# Altium project PCB_Project.PrjPcb (part 1 of 2)
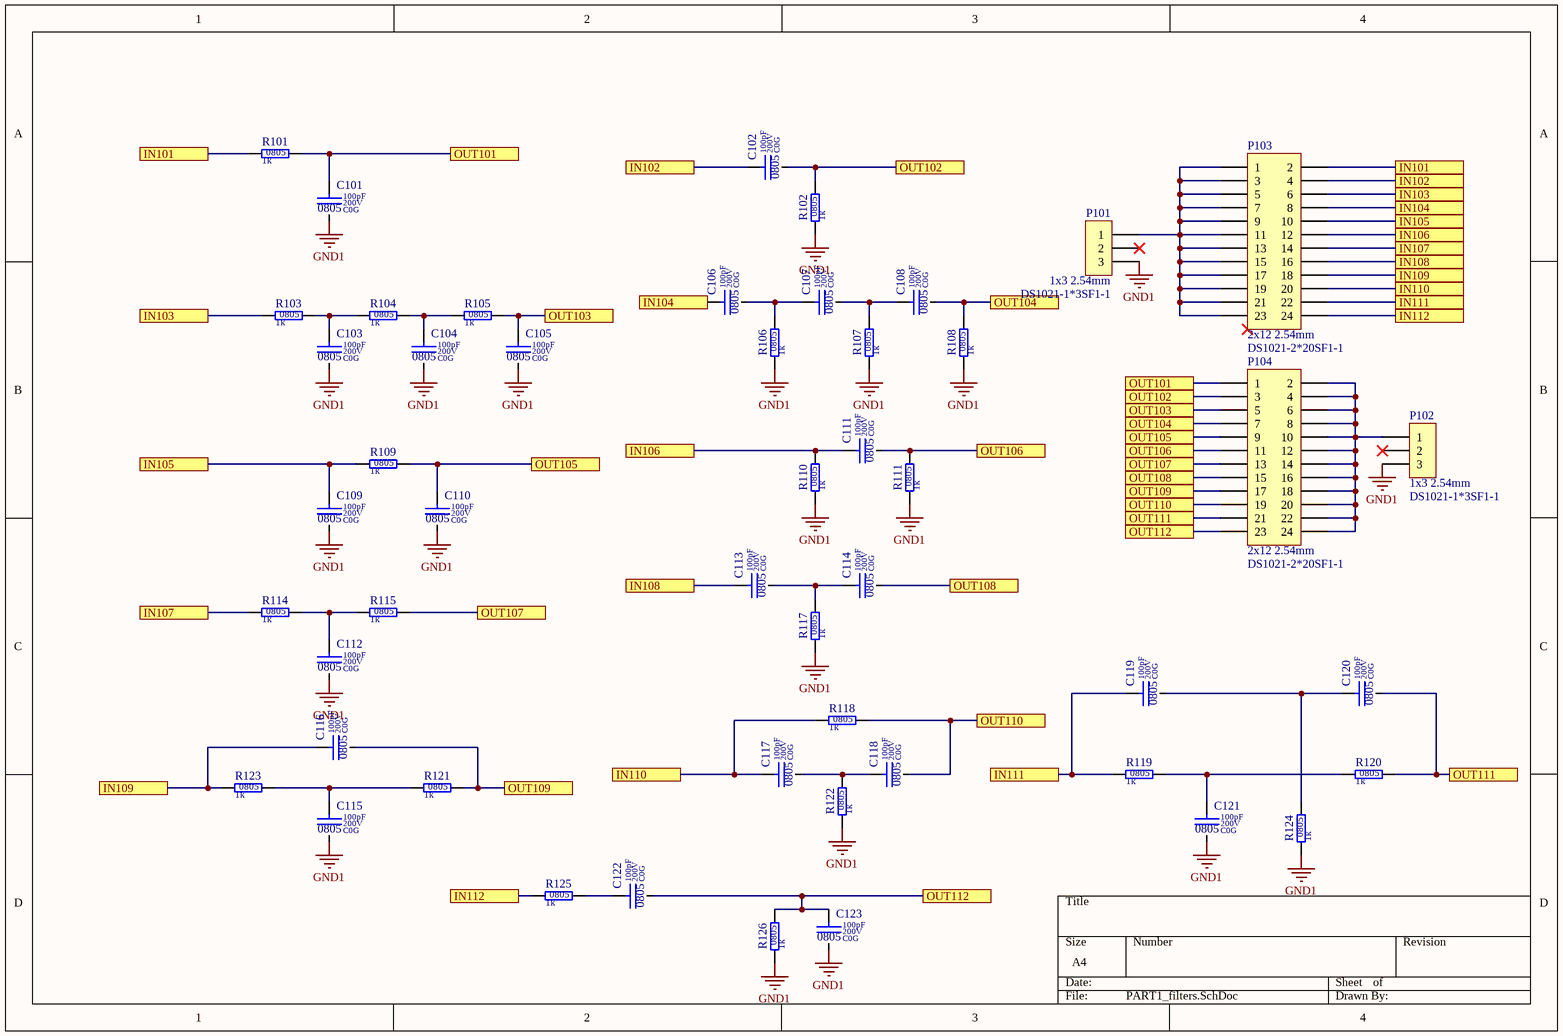
[diagram p0: PART1_filters.SchDoc]
12 sheets, 220 parts. Net scope: flat (ports and power ports of the same name join across sheets).
Board file: PCB1.PcbDoc
Sheets:
  PART1_filters.SchDoc
  PART2_zener_stab.SchDoc
  PART3_Volt_Reg.SchDoc
  PART4_CMOS_Driver.SchDoc
  PART5_Step_Down_PSU.SchDoc
  PART6_Step_Up_PSU.SchDoc
  PART8_Volt_Multipl.SchDoc
  PART7_op_amp.SchDoc
  PART9_0_Volt_Protec_Simple.SchDoc
  PART10_Ast_Multivib_w_DC_DC_COnv.SchDoc
  PART11_Rectifier.SchDoc
  GND.SchDoc

## Sheet PART1_filters.SchDoc: PART1_RC_filters
size A4

### Parts
C101  value 100pF  Dielectric: C0G  Voltage: 200V  SCH_Footprint: 0805  [C_0805_2012]  (hidden comment: Ceramic C0G)
C102  value 100pF  Dielectric: C0G  Voltage: 200V  SCH_Footprint: 0805  [C_0805_2012]  (hidden comment: Ceramic C0G)
C103  value 100pF  Dielectric: C0G  Voltage: 200V  SCH_Footprint: 0805  [C_0805_2012]  (hidden comment: Ceramic C0G)
C104  value 100pF  Dielectric: C0G  Voltage: 200V  SCH_Footprint: 0805  [C_0805_2012]  (hidden comment: Ceramic C0G)
C105  value 100pF  Dielectric: C0G  Voltage: 200V  SCH_Footprint: 0805  [C_0805_2012]  (hidden comment: Ceramic C0G)
C106  value 100pF  Dielectric: C0G  Voltage: 200V  SCH_Footprint: 0805  [C_0805_2012]  (hidden comment: Ceramic C0G)
C107  value 100pF  Dielectric: C0G  Voltage: 200V  SCH_Footprint: 0805  [C_0805_2012]  (hidden comment: Ceramic C0G)
C108  value 100pF  Dielectric: C0G  Voltage: 200V  SCH_Footprint: 0805  [C_0805_2012]  (hidden comment: Ceramic C0G)
C109  value 100pF  Dielectric: C0G  Voltage: 200V  SCH_Footprint: 0805  [C_0805_2012]  (hidden comment: Ceramic C0G)
C110  value 100pF  Dielectric: C0G  Voltage: 200V  SCH_Footprint: 0805  [C_0805_2012]  (hidden comment: Ceramic C0G)
C111  value 100pF  Dielectric: C0G  Voltage: 200V  SCH_Footprint: 0805  [C_0805_2012]  (hidden comment: Ceramic C0G)
C112  value 100pF  Dielectric: C0G  Voltage: 200V  SCH_Footprint: 0805  [C_0805_2012]  (hidden comment: Ceramic C0G)
C113  value 100pF  Dielectric: C0G  Voltage: 200V  SCH_Footprint: 0805  [C_0805_2012]  (hidden comment: Ceramic C0G)
C114  value 100pF  Dielectric: C0G  Voltage: 200V  SCH_Footprint: 0805  [C_0805_2012]  (hidden comment: Ceramic C0G)
C115  value 100pF  Dielectric: C0G  Voltage: 200V  SCH_Footprint: 0805  [C_0805_2012]  (hidden comment: Ceramic C0G)
C116  value 100pF  Dielectric: C0G  Voltage: 200V  SCH_Footprint: 0805  [C_0805_2012]  (hidden comment: Ceramic C0G)
C117  value 100pF  Dielectric: C0G  Voltage: 200V  SCH_Footprint: 0805  [C_0805_2012]  (hidden comment: Ceramic C0G)
C118  value 100pF  Dielectric: C0G  Voltage: 200V  SCH_Footprint: 0805  [C_0805_2012]  (hidden comment: Ceramic C0G)
C119  value 100pF  Dielectric: C0G  Voltage: 200V  SCH_Footprint: 0805  [C_0805_2012]  (hidden comment: Ceramic C0G)
C120  value 100pF  Dielectric: C0G  Voltage: 200V  SCH_Footprint: 0805  [C_0805_2012]  (hidden comment: Ceramic C0G)
C121  value 100pF  Dielectric: C0G  Voltage: 200V  SCH_Footprint: 0805  [C_0805_2012]  (hidden comment: Ceramic C0G)
C122  value 100pF  Dielectric: C0G  Voltage: 200V  SCH_Footprint: 0805  [C_0805_2012]  (hidden comment: Ceramic C0G)
C123  value 100pF  Dielectric: C0G  Voltage: 200V  SCH_Footprint: 0805  [C_0805_2012]  (hidden comment: Ceramic C0G)
P101  value DS1021-1*3SF1-1  SCH_Footprint: 1x3 2.54mm  [P_HEADER_1x3_2.54]  (hidden comment: Goldpin)
P102  value DS1021-1*3SF1-1  SCH_Footprint: 1x3 2.54mm  [P_HEADER_1x3_2.54]  (hidden comment: Goldpin)
P103  value DS1021-2*20SF1-1  SCH_Footprint: 2x12 2.54mm  [P_HEADER_2x12_2.54]  (hidden comment: IN)
P104  value DS1021-2*20SF1-1  SCH_Footprint: 2x12 2.54mm  [P_HEADER_2x12_2.54]  (hidden comment: OUT)
R101  value 1k  SCH_Footprint: 0805  [R_0805_2012]  (hidden comment: Resistor)
R102  value 1k  SCH_Footprint: 0805  [R_0805_2012]  (hidden comment: Resistor)
R103  value 1k  SCH_Footprint: 0805  [R_0805_2012]  (hidden comment: Resistor)
R104  value 1k  SCH_Footprint: 0805  [R_0805_2012]  (hidden comment: Resistor)
R105  value 1k  SCH_Footprint: 0805  [R_0805_2012]  (hidden comment: Resistor)
R106  value 1k  SCH_Footprint: 0805  [R_0805_2012]  (hidden comment: Resistor)
R107  value 1k  SCH_Footprint: 0805  [R_0805_2012]  (hidden comment: Resistor)
R108  value 1k  SCH_Footprint: 0805  [R_0805_2012]  (hidden comment: Resistor)
R109  value 1k  SCH_Footprint: 0805  [R_0805_2012]  (hidden comment: Resistor)
R110  value 1k  SCH_Footprint: 0805  [R_0805_2012]  (hidden comment: Resistor)
R111  value 1k  SCH_Footprint: 0805  [R_0805_2012]  (hidden comment: Resistor)
R114  value 1k  SCH_Footprint: 0805  [R_0805_2012]  (hidden comment: Resistor)
R115  value 1k  SCH_Footprint: 0805  [R_0805_2012]  (hidden comment: Resistor)
R117  value 1k  SCH_Footprint: 0805  [R_0805_2012]  (hidden comment: Resistor)
R118  value 1k  SCH_Footprint: 0805  [R_0805_2012]  (hidden comment: Resistor)
R119  value 1k  SCH_Footprint: 0805  [R_0805_2012]  (hidden comment: Resistor)
R120  value 1k  SCH_Footprint: 0805  [R_0805_2012]  (hidden comment: Resistor)
R121  value 1k  SCH_Footprint: 0805  [R_0805_2012]  (hidden comment: Resistor)
R122  value 1k  SCH_Footprint: 0805  [R_0805_2012]  (hidden comment: Resistor)
R123  value 1k  SCH_Footprint: 0805  [R_0805_2012]  (hidden comment: Resistor)
R124  value 1k  SCH_Footprint: 0805  [R_0805_2012]  (hidden comment: Resistor)
R125  value 1k  SCH_Footprint: 0805  [R_0805_2012]  (hidden comment: Resistor)
R126  value 1k  SCH_Footprint: 0805  [R_0805_2012]  (hidden comment: Resistor)

### Ports
IN101, IN102, IN103, IN104, IN105, IN106, IN107, IN108, IN109, IN110, IN111, IN112, OUT101, OUT102, OUT103, OUT104, OUT105, OUT106, OUT107, OUT108, OUT109, OUT110, OUT111, OUT112

### Nets
GND1: C101.2 C103.2 C104.2 C105.2 C109.2 C110.2 C112.2 C115.2 C121.2 C123.2 P101.3 P102.3 R102.1 R106.1 R107.1 R108.1 R110.1 R111.1 R117.1 R122.1 R124.1 R126.1
NetC101_1: C101.1 P104.1 R101.2 ; port OUT101
NetC102_1: C102.1 P103.4 ; port IN102
NetC102_2: C102.2 P104.3 R102.2 ; port OUT102
NetC103_1: C103.1 R103.2 R104.1
NetC104_1: C104.1 R104.2 R105.1
NetC105_1: C105.1 P104.5 R105.2 ; port OUT103
NetC106_1: C106.1 P103.8 ; port IN104
NetC106_2: C106.2 C107.1 R106.2
NetC107_2: C107.2 C108.1 R107.2
NetC108_2: C108.2 P104.7 R108.2 ; port OUT104
NetC109_1: C109.1 P103.10 R109.1 ; port IN105
NetC110_1: C110.1 P104.9 R109.2 ; port OUT105
NetC111_1: C111.1 P103.12 R110.2 ; port IN106
NetC111_2: C111.2 P104.11 R111.2 ; port OUT106
NetC112_1: C112.1 R114.2 R115.1
NetC113_1: C113.1 P103.16 ; port IN108
NetC113_2: C113.2 C114.1 R117.2
NetC114_2: C114.2 P104.15 ; port OUT108
NetC115_1: C115.1 R121.1 R123.2
NetC116_1: C116.1 P103.18 R123.1 ; port IN109
NetC116_2: C116.2 P104.17 R121.2 ; port OUT109
NetC117_1: C117.1 P103.20 R118.1 ; port IN110
NetC117_2: C117.2 C118.1 R122.2
NetC118_2: C118.2 P104.19 R118.2 ; port OUT110
NetC119_1: C119.1 P103.22 R119.1 ; port IN111
NetC119_2: C119.2 C120.1 R124.2
NetC120_2: C120.2 P104.21 R120.2 ; port OUT111
NetC121_1: C121.1 R119.2 R120.1
NetC122_1: C122.1 R125.2
NetC122_2: C122.2 C123.1 P104.23 R126.2 ; port OUT112
NetP101_1: P101.1 P103.1 P103.3 P103.5 P103.7 P103.9 P103.11 P103.13 P103.15 P103.17 P103.19 P103.21 P103.23
NetP102_1: P102.1 P104.2 P104.4 P104.6 P104.8 P104.10 P104.12 P104.14 P104.16 P104.18 P104.20 P104.22 P104.24
NetP103_2: P103.2 R101.1 ; port IN101
NetP103_6: P103.6 R103.1 ; port IN103
NetP103_14: P103.14 R114.1 ; port IN107
NetP103_24: P103.24 R125.1 ; port IN112
NetP104_13: P104.13 R115.2 ; port OUT107

Not connected (* = marked no-connect by the designer): P101 2*; P102 2*

### Library data of the parts
C101-C123 = C_100pF_200V_C0G_0805_5: Capacitor; Manufacturer: KEMET; Manufacturer Part Number: C0805C101J2GACTU; Tolerance (%): 5; Part Number: C_100pF_200V_C0G_0805_5; HelpURL: http://www.tme.eu/pl/Document/a556da97341b52257167181ac42b746d/KEM_C1003_C0G_SMD.pdf; Supplier 1: TME; Supplier Part Number 1: C0805C101J2GAC; Supplier 2: RS Components; Supplier 3: Farnell; Supplier 4: Mouser; Supplier 5: Digi-Key
P101 P102 = P_HEADER_1x3_2.54: Pin Header; Manufacturer: Connfly; Part Number: P_HEADER_1x3_2.54; Component Type: Standard; HelpURL: http://www.tme.eu/en/Document/cc301e58a5da78cb543a94b5a5b7f06a/DS1021.pdf; Manufacturer Part Number: DS1021-1*3SF1-1; Supplier 1: TME; Supplier Part Number 1: ZL201-03G; Supplier 2: RS Components; Supplier 3: Farnell; Supplier 4: Mouser; Supplier 5: Digi-Key
P103 P104 = P_HEADER_2x12_2.54: Pin Header; Manufacturer: Connfly; Part Number: P_HEADER_2x12_2.54; Component Type: Standard; HelpURL: https://www.tme.eu/Document/cc301e58a5da78cb543a94b5a5b7f06a/DS1021.pdf; Manufacturer Part Number: DS1021-2*20SF1-1; Supplier 1: TME; Supplier Part Number 1: ZL202-40G; Supplier 2: RS Components; Supplier 3: Farnell; Supplier 4: Mouser; Supplier 5: Digi-Key
R101-R111 R114 R115 R117-R126 = R_1k_0805_1: Manufacturer: Royalohm; Manufacturer Part Number: HP05W3F1001T5E; Voltage: 150V; Power: 300mW; Tolerance: 1%; Part Number: R_1k_0805_1; HelpURL: https://www.tme.eu/pl/Document/63d5a2fbb689d2d511047d7cc8640cd8/chip_resistor_hp.pdf; Supplier 1: TME; Supplier Part Number 1: HP05-1K1%; Supplier 2: RS Components; Supplier 3: Farnell; Supplier 4: Mouser; Supplier 5: Digi-Key

## Sheet PART2_zener_stab.SchDoc
size A4
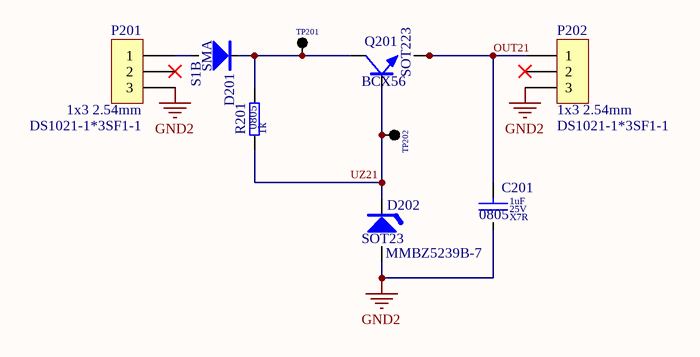
[diagram p1: PART2_zener_stab.SchDoc]

### Parts
C201  value 1uF  Dielectric: X7R  Voltage: 25V  SCH_Footprint: 0805  [C_0805_2012]  (hidden comment: Ceramic X7R)
D201  value S1B  SCH_Footprint: SMA  [SMA_DO-214AC]
D202  value MMBZ5239B-7  SCH_Footprint: SOT23  [D_SOT23_TO236_SC59]
P201  value DS1021-1*3SF1-1  SCH_Footprint: 1x3 2.54mm  [P_HEADER_1x3_2.54]  (hidden comment: Goldpin)
P202  value DS1021-1*3SF1-1  SCH_Footprint: 1x3 2.54mm  [P_HEADER_1x3_2.54]  (hidden comment: Goldpin)
Q201  SCH_Footprint: SOT223  [SOT-223_M]  (hidden comment: BCX56)
R201  value 1k  SCH_Footprint: 0805  [R_0805_2012]  (hidden comment: Resistor)
TP201  Single pin  [TP_1PIN]  (value not drawn)
TP202  Single pin  [TP_1PIN]  (value not drawn)

### Nets
GND2: C201.2 D202.2(A) P201.3 P202.3
OUT21: C201.1 P202.1 Q201.1(C) Q201.3(E)
UZ21: D202.1(K) Q201.4(B) R201.1 TP202.1(TP)
NetD201_1: D201.1 Q201.2(C) R201.2 TP201.1(TP)
NetD201_2: D201.2 P201.1

Not connected (* = marked no-connect by the designer): P201 2*; P202 2*

### Library data of the parts
C201 = C_1uF_25V_X7R_0805_10: Capacitor; Manufacturer: AVX; Manufacturer Part Number: 08053C105KAT2A; Tolerance (%): 10; Part Number: C_1uF_25V_X7R_0805_10; HelpURL: https://www.tme.eu/Document/667fe6e7748c0ed1675574c6bf64b751/AVX_X7R.pdf; Supplier 1: TME; Supplier Part Number 1: 08053C105KAT2A; Supplier 2: RS Components; Supplier Part Number 2: 1351396; Supplier 3: Farnell; Supplier Part Number 3: 1658877; Supplier 4: Mouser; Supplier Part Number 4: 581-08053C105KAT2A; Supplier 5: Digi-Key; Supplier Part Number 5: 478-5030-1-ND
D201 = D_S1B_1A_100V_SMA: Manufacturer: Vishay/General Semiconductor; Voltage: 100V; Current: 1A; Part Number: D_S1B_1A_100V_SMA; Manufacturer Part Number: S1B; Supplier 1: TME; Supplier 2: RS Components; Supplier 3: Farnell; Supplier 4: Mouser; Supplier Part Number 4: 821-S1B; Supplier 5: Digi-Key; Supplier Part Number 5: S1B/51GI
D202 = DZ_9V1_SOT23: Zener; Manufacturer: Diodes Inc; Voltage: 9.1V; Part Number: DZ_9V1_SOT23; Manufacturer Part Number: MMBZ5239B-7; Supplier 1: TME; Supplier 2: RS Components; Supplier 3: Farnell; Supplier 4: Mouser; Supplier 5: Digi-Key; Supplier Part Number 5: MMBZ5239B-FDICT-ND
P201 P202 = P_HEADER_1x3_2.54: Pin Header; Manufacturer: Connfly; Part Number: P_HEADER_1x3_2.54; Component Type: Standard; HelpURL: http://www.tme.eu/en/Document/cc301e58a5da78cb543a94b5a5b7f06a/DS1021.pdf; Manufacturer Part Number: DS1021-1*3SF1-1; Supplier 1: TME; Supplier Part Number 1: ZL201-03G; Supplier 2: RS Components; Supplier 3: Farnell; Supplier 4: Mouser; Supplier 5: Digi-Key
Q201 = QNP_BCX56: Manufacturer: Nexperia; Type: NPN; Voltage: 80V; Current: 1A; Part Number: QNP_BCX56; Value: BCX56; HelpURL: https://datasheet.octopart.com/BCX56-10%2C115-Nexperia-datasheet-78799842.pdf; Manufacturer Part Number: BCX56; Supplier 1: TME; Supplier 2: RS Components; Supplier Part Number 2: 725-8540; Supplier 3: Farnell; Supplier Part Number 3: 1757914; Supplier 4: Mouser; Supplier Part Number 4: 771-BCX56-10-T/R; Supplier 5: Digi-Key; Supplier Part Number 5: 1727-4318-1-ND-ND
R201 = R_1k_0805_1: as R101 on sheet PART1_filters; Part Number: R_1k_0805_1; HelpURL: https://www.tme.eu/pl/Document/63d5a2fbb689d2d511047d7cc8640cd8/chip_resistor_hp.pdf; Supplier 1: TME; Supplier Part Number 1: HP05-1K1%; Supplier 2: RS Components; Supplier 3: Farnell; Supplier 4: Mouser; Supplier 5: Digi-Key
TP201 TP202 = TP_1PIN: Testpoint; SCH_Footprint: Single; Part Number: TP_1PIN; Component Type: Standard; Supplier 1: TME; Supplier 2: RS Components; Supplier 3: Farnell; Supplier 4: Mouser; Supplier 5: Digi-Key

## Sheet PART3_Volt_Reg.SchDoc
size A4
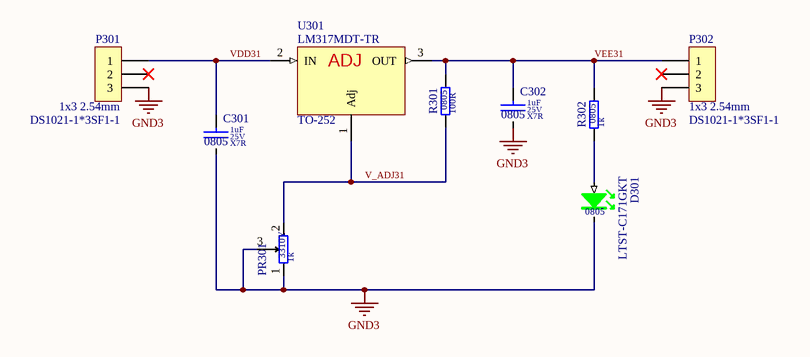
[diagram p2: PART3_Volt_Reg.SchDoc]

### Parts
C301  value 1uF  Dielectric: X7R  Voltage: 25V  SCH_Footprint: 0805  [C_0805_2012]  (hidden comment: Ceramic X7R)
C302  value 1uF  Dielectric: X7R  Voltage: 25V  SCH_Footprint: 0805  [C_0805_2012]  (hidden comment: Ceramic X7R)
D301  value LTST-C171GKT  SCH_Footprint: 0805  [OL_0805_2012]  (hidden comment: Green led)
P301  value DS1021-1*3SF1-1  SCH_Footprint: 1x3 2.54mm  [P_HEADER_1x3_2.54]  (hidden comment: Goldpin)
P302  value DS1021-1*3SF1-1  SCH_Footprint: 1x3 2.54mm  [P_HEADER_1x3_2.54]  (hidden comment: Goldpin)
PR301  value 1k  [3310Y]  (hidden comment: Resistor)
R301  value 100R  SCH_Footprint: 0805  [R_0805_2012]  (hidden comment: Resistor)
R302  value 1k  SCH_Footprint: 0805  [R_0805_2012]  (hidden comment: Resistor)
U301  value LM317MDT-TR  [TO-252]

### Nets
GND3: C301.2 C302.2 D301.1(K) P301.3 P302.3 PR301.1 PR301.3
V_ADJ31: PR301.2 R301.1 U301.1(Adj)
VDD31: C301.1 P301.1 U301.2(IN)
VEE31: C302.1 P302.1 R301.2 R302.2 U301.3(OUT)
NetD301_2: D301.2(A) R302.1

Not connected (* = marked no-connect by the designer): P301 2*; P302 2*

### Library data of the parts
C301 C302 = C_1uF_25V_X7R_0805_10: as C201 on sheet PART2_zener_stab; Part Number: C_1uF_25V_X7R_0805_10; HelpURL: https://www.tme.eu/Document/667fe6e7748c0ed1675574c6bf64b751/AVX_X7R.pdf; Supplier 1: TME; Supplier Part Number 1: 08053C105KAT2A; Supplier 2: RS Components; Supplier Part Number 2: 1351396; Supplier 3: Farnell; Supplier Part Number 3: 1658877; Supplier 4: Mouser; Supplier Part Number 4: 581-08053C105KAT2A; Supplier 5: Digi-Key; Supplier Part Number 5: 478-5030-1-ND
D301 = OL_G_0805_0C006_LTST-C171GKT: LED GREEN; Manufacturer: Lite-On; Part Number: OL_G_0805_0C006_LTST-C171GKT; HelpURL: http://datasheet.octopart.com/LTST-C171GKT-Lite-On-datasheet-158474.pdf; Manufacturer Part Number: LTST-C171GKT; Supplier 1: TME; Supplier Part Number 1: LTST-C171GKT; Supplier 2: RS Components; Supplier Part Number 2: 6920935; Supplier 3: Farnell; Supplier 4: Mouser; Supplier Part Number 4: 859-LTST-C171GKT; Supplier 5: Digi-Key; Supplier Part Number 5: 160-1423-1-ND
P301 P302 = P_HEADER_1x3_2.54: Pin Header; Manufacturer: Connfly; Part Number: P_HEADER_1x3_2.54; Component Type: Standard; HelpURL: http://www.tme.eu/en/Document/cc301e58a5da78cb543a94b5a5b7f06a/DS1021.pdf; Manufacturer Part Number: DS1021-1*3SF1-1; Supplier 1: TME; Supplier Part Number 1: ZL201-03G; Supplier 2: RS Components; Supplier 3: Farnell; Supplier 4: Mouser; Supplier 5: Digi-Key
PR301 = R_1k_3310Y_20: Manufacturer: Bourns; Manufacturer Part Number: 3310Y-001-102L; Voltage: 50V; Power: 250mW; Tolerance: 20%; SCH_Footprint: 3310Y; Part Number: R_1k_3310Y_20; HelpURL: https://docs.rs-online.com/4641/0900766b8069b9f0.pdf; Supplier 1: TME; Supplier Part Number 1: 3310Y-001-102L; Supplier 2: RS Components; Supplier Part Number 2: 522-0603P; Supplier 3: Farnell; Supplier Part Number 3: 1156139; Supplier 4: Mouser; Supplier Part Number 4: 652-3310Y-001-102L; Supplier 5: Digi-Key; Supplier Part Number 5: 3310Y-001-102L-ND
R301 = R_100R_0805_1: Manufacturer: Yageo; Manufacturer Part Number: RC0805FR-07100RL; Voltage: 150V; Power: 125mW; Tolerance: 1%; Part Number: R_100R_0805_1; HelpURL: https://www.tme.eu/pl/Document/7b8fed8c112f8a94930279c22c957f7f/rc0805yageo.pdf; Supplier 1: TME; Supplier Part Number 1: RC0805FR-07100R; Supplier 2: RS Components; Supplier Part Number 2: 618-5135; Supplier 3: Farnell; Supplier Part Number 3: 9237364; Supplier 4: Mouser; Supplier Part Number 4: 603-RC0805FR-07100RL; Supplier 5: Digi-Key; Supplier Part Number 5: 311-100CRCT-ND
R302 = R_1k_0805_1: as R101 on sheet PART1_filters; Part Number: R_1k_0805_1; HelpURL: https://www.tme.eu/pl/Document/63d5a2fbb689d2d511047d7cc8640cd8/chip_resistor_hp.pdf; Supplier 1: TME; Supplier Part Number 1: HP05-1K1%; Supplier 2: RS Components; Supplier 3: Farnell; Supplier 4: Mouser; Supplier 5: Digi-Key
U301 = VL_LM317MDT: configuration with adjust; Manufacturer: STMicroelectronics; Voltage: ADJ; Current: 1A; SCH_Footprint: TO-252; Part Number: VL_LM317MDT; HelpURL: https://datasheet.octopart.com/LM317MDT-TR-STMicroelectronics-datasheet-10674389.pdf; Manufacturer Part Number: LM317MDT-TR; Supplier 1: TME; Supplier Part Number 1: LM317MDT-TR; Supplier 2: RS Components; Supplier Part Number 2: 7140798; Supplier 3: Farnell; Supplier Part Number 3: 2296022; Supplier 4: Mouser; Supplier Part Number 4: 511-LM317MDT-TR; Supplier 5: Digi-Key; Supplier Part Number 5: 497-1574-1-ND

## Sheet PART4_CMOS_Driver.SchDoc
size A4
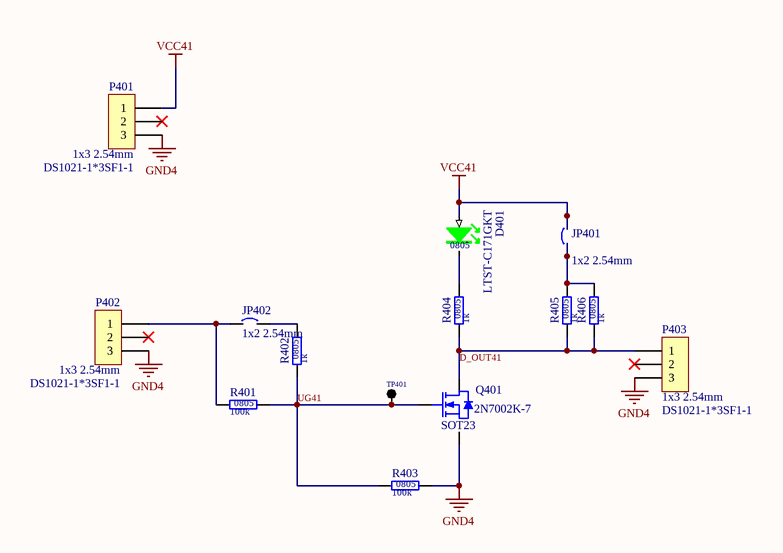
[diagram p3: PART4_CMOS_Driver.SchDoc]

### Parts
D401  value LTST-C171GKT  SCH_Footprint: 0805  [OL_0805_2012]  (hidden comment: Green led)
JP401  SCH_Footprint: 1x2 2.54mm  [P_HEADER_1x2_2.54]  (hidden comment: Goldpin)
JP402  SCH_Footprint: 1x2 2.54mm  [P_HEADER_1x2_2.54]  (hidden comment: Goldpin)
P401  value DS1021-1*3SF1-1  SCH_Footprint: 1x3 2.54mm  [P_HEADER_1x3_2.54]  (hidden comment: Goldpin)
P402  value DS1021-1*3SF1-1  SCH_Footprint: 1x3 2.54mm  [P_HEADER_1x3_2.54]  (hidden comment: Goldpin)
P403  value DS1021-1*3SF1-1  SCH_Footprint: 1x3 2.54mm  [P_HEADER_1x3_2.54]  (hidden comment: Goldpin)
Q401  SCH_Footprint: SOT23  [SOT23_TO236_SC59]  (hidden comment: 2N7002K-7)
R401  value 100k  SCH_Footprint: 0805  [R_0805_2012]  (hidden comment: Resistor)
R402  value 1k  SCH_Footprint: 0805  [R_0805_2012]  (hidden comment: Resistor)
R403  value 100k  SCH_Footprint: 0805  [R_0805_2012]  (hidden comment: Resistor)
R404  value 1k  SCH_Footprint: 0805  [R_0805_2012]  (hidden comment: Resistor)
R405  value 1k  SCH_Footprint: 0805  [R_0805_2012]  (hidden comment: Resistor)
R406  value 1k  SCH_Footprint: 0805  [R_0805_2012]  (hidden comment: Resistor)
TP401  Single pin  [TP_1PIN]  (value not drawn)

### Nets
GND4: P401.3 P402.3 P403.3 Q401.2(S) R403.2
VCC41: D401.2(A) JP401.2 P401.1
D_OUT41: P403.1 Q401.3(D) R404.1 R405.1 R406.1
UG41: Q401.1(G) R401.2 R402.1 R403.1 TP401.1(TP)
NetD401_1: D401.1(K) R404.2
NetJP401_1: JP401.1 R405.2 R406.2
NetJP402_1: JP402.1 P402.1 R401.1
NetJP402_2: JP402.2 R402.2

Not connected (* = marked no-connect by the designer): P401 2*; P402 2*; P403 2*

### Library data of the parts
D401 = OL_G_0805_0C006_LTST-C171GKT: LED GREEN; Manufacturer: Lite-On; Part Number: OL_G_0805_0C006_LTST-C171GKT; HelpURL: http://datasheet.octopart.com/LTST-C171GKT-Lite-On-datasheet-158474.pdf; Manufacturer Part Number: LTST-C171GKT; Supplier 1: TME; Supplier Part Number 1: LTST-C171GKT; Supplier 2: RS Components; Supplier Part Number 2: 6920935; Supplier 3: Farnell; Supplier 4: Mouser; Supplier Part Number 4: 859-LTST-C171GKT; Supplier 5: Digi-Key; Supplier Part Number 5: 160-1423-1-ND
JP401 JP402 = CB_GOLDPIN: Circuit Breaker; Part Number: CB_GOLDPIN; Component Type: Standard; Supplier 1: TME; Supplier 2: RS Components; Supplier 3: Farnell; Supplier 4: Mouser; Supplier 5: Digi-Key
P401-P403 = P_HEADER_1x3_2.54: Pin Header; Manufacturer: Connfly; Part Number: P_HEADER_1x3_2.54; Component Type: Standard; HelpURL: http://www.tme.eu/en/Document/cc301e58a5da78cb543a94b5a5b7f06a/DS1021.pdf; Manufacturer Part Number: DS1021-1*3SF1-1; Supplier 1: TME; Supplier Part Number 1: ZL201-03G; Supplier 2: RS Components; Supplier 3: Farnell; Supplier 4: Mouser; Supplier 5: Digi-Key
Q401 = QN_2N7002K-7_60V_350mA: Manufacturer: DIODES inc; Type: N-MOS; Voltage: 60V; Current: 0A8; Part Number: QN_2N7002K-7_60V_350mA; Value: 2N7002K-7; HelpURL: http://datasheet.octopart.com/2N7002K-7-Diodes-Inc.-datasheet-12515815.pdf; Manufacturer Part Number: 2N7002K-7; Supplier 1: TME; Supplier 2: RS Components; Supplier Part Number 2: 7703383; Supplier 3: Farnell; Supplier Part Number 3: 1713825; Supplier 4: Mouser; Supplier Part Number 4: 621-2N7002K-7; Supplier 5: Digi-Key; Supplier Part Number 5: 2N7002K-7DICT-ND
R401 R403 = R_100k_0805_1: Manufacturer: Yageo; Manufacturer Part Number: RC0805FR-07100KL; Voltage: 150V; Power: 125mW; Tolerance: 1%; Part Number: R_100k_0805_1; HelpURL: https://pl.mouser.com/datasheet/2/447/PYu-RC_Group_51_RoHS_L_9-1314892.pdf; Supplier 1: TME; Supplier Part Number 1: RC0805FR-07100K; Supplier 2: RS Components; Supplier 3: Farnell; Supplier Part Number 3: 9237879; Supplier 4: Mouser; Supplier Part Number 4: 603-RC0805FR-07100KL; Supplier 5: Digi-Key; Supplier Part Number 5: 311-100KCRCT-ND
R402 R404-R406 = R_1k_0805_1: as R101 on sheet PART1_filters; Part Number: R_1k_0805_1; HelpURL: https://www.tme.eu/pl/Document/63d5a2fbb689d2d511047d7cc8640cd8/chip_resistor_hp.pdf; Supplier 1: TME; Supplier Part Number 1: HP05-1K1%; Supplier 2: RS Components; Supplier 3: Farnell; Supplier 4: Mouser; Supplier 5: Digi-Key
TP401 = TP_1PIN: Testpoint; SCH_Footprint: Single; Part Number: TP_1PIN; Component Type: Standard; Supplier 1: TME; Supplier 2: RS Components; Supplier 3: Farnell; Supplier 4: Mouser; Supplier 5: Digi-Key

## Sheet PART5_Step_Down_PSU.SchDoc
size A4
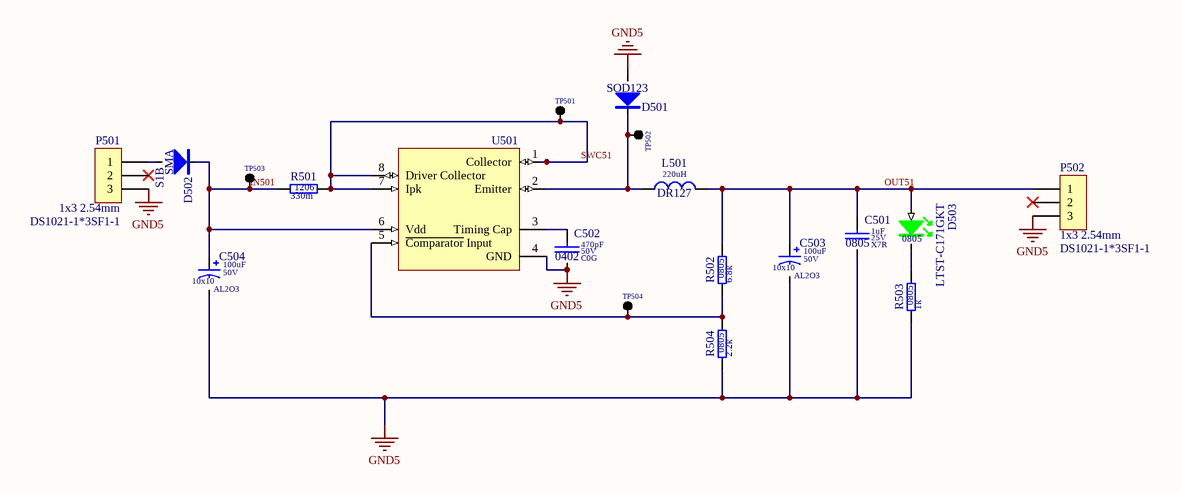
[diagram p4: PART5_Step_Down_PSU.SchDoc]

### Parts
C501  value 1uF  Dielectric: X7R  Voltage: 25V  SCH_Footprint: 0805  [C_0805_2012]  (hidden comment: Ceramic X7R)
C502  value 470pF  Dielectric: C0G  Voltage: 50V  SCH_Footprint: 0402  [C_0402_1005]  (hidden comment: Ceramic C0G)
C503  value 100uF  Dielectric: AL2O3  SCH_Footprint: 10x10  Voltage: 50V  [CE_D_10x10MM]  (hidden comment: Electrolytic Capacitor)
C504  value 100uF  Dielectric: AL2O3  SCH_Footprint: 10x10  Voltage: 50V  [CE_D_10x10MM]  (hidden comment: Electrolytic Capacitor)
D501  1N5819HW  [SOD123]  (value not drawn)
D502  value S1B  SCH_Footprint: SMA  [SMA_DO-214AC]
D503  value LTST-C171GKT  SCH_Footprint: 0805  [OL_0805_2012]  (hidden comment: Green led)
L501  value 220uH  SCH_Footprint: DR127  [L_DR127]  (hidden comment: Inductor)
P501  value DS1021-1*3SF1-1  SCH_Footprint: 1x3 2.54mm  [P_HEADER_1x3_2.54]  (hidden comment: Goldpin)
P502  value DS1021-1*3SF1-1  SCH_Footprint: 1x3 2.54mm  [P_HEADER_1x3_2.54]  (hidden comment: Goldpin)
R501  value 330m  SCH_Footprint: 1206  [R_1206_3216]  (hidden comment: Resistor)
R502  value 6.8k  SCH_Footprint: 0805  [R_0805_2012]  (hidden comment: Resistor)
R503  value 1k  SCH_Footprint: 0805  [R_0805_2012]  (hidden comment: Resistor)
R504  value 2.2k  SCH_Footprint: 0805  [R_0805_2012]  (hidden comment: Resistor)
TP501  Single pin  [TP_1PIN]  (value not drawn)
TP502  Single pin  [TP_1PIN]  (value not drawn)
TP503  Single pin  [TP_1PIN]  (value not drawn)
TP504  Single pin  [TP_1PIN]  (value not drawn)
U501  1.5-A Peak Boost/Buck/Inverting Switching Regulators  [SOP8_SO8_SOIC8_4X5X18]  (value not drawn)

### Nets
GND5: C501.2 C502.2 C503.2 C504.2 D501.2 P501.3 P502.3 R503.1 R504.1 U501.4(GND)
IN501: C504.1 D502.1 R501.1 TP503.1(TP) U501.6(Vdd)
OUT51: C501.1 C503.1 D503.2(A) L501.2 P502.1 R502.2
SWC51: R501.2 TP501.1(TP) U501.1(Collector) U501.7(Ipk) U501.8(Driver_Collector)
NetC502_1: C502.1 U501.3(Timing_Cap)
NetD501_1: D501.1 L501.1 TP502.1(TP) U501.2(Emitter)
NetD502_2: D502.2 P501.1
NetD503_1: D503.1(K) R503.2
NetR502_1: R502.1 R504.2 TP504.1(TP) U501.5(~{Comparator}_Input)

Not connected (* = marked no-connect by the designer): P501 2*; P502 2*

### Library data of the parts
C501 = C_1uF_25V_X7R_0805_10: as C201 on sheet PART2_zener_stab; Part Number: C_1uF_25V_X7R_0805_10; HelpURL: https://www.tme.eu/Document/667fe6e7748c0ed1675574c6bf64b751/AVX_X7R.pdf; Supplier 1: TME; Supplier Part Number 1: 08053C105KAT2A; Supplier 2: RS Components; Supplier Part Number 2: 1351396; Supplier 3: Farnell; Supplier Part Number 3: 1658877; Supplier 4: Mouser; Supplier Part Number 4: 581-08053C105KAT2A; Supplier 5: Digi-Key; Supplier Part Number 5: 478-5030-1-ND
C502 = C_470pF_50V_C0G_0402_5: Capacitor; Manufacturer: AVX; Manufacturer Part Number: 04025A471JAT2A; Tolerance (%): 5; Part Number: C_470pF_50V_C0G_0402_5; HelpURL: http://datasheet.octopart.com/04025A471JAT2A-AVX-datasheet-9883399.pdf; Supplier 1: TME; Supplier 2: RS Components; Supplier Part Number 2: 6983119P; Supplier 3: Farnell; Supplier Part Number 3: 2280781; Supplier 4: Mouser; Supplier Part Number 4: 581-04025A471JAT2A; Supplier 5: Digi-Key; Supplier Part Number 5: 478-7880-1-ND
C503 C504 = CE_100uF_50V_AL2O3_10x10_20: Polarized Capacitor; Manufacturer: Nichicon; Manufacturer Part Number: UUX1H101MNL1GS; Tolerance (%): 20; Part Number: CE_100uF_50V_AL2O3_10x10_20; HelpURL: https://datasheet.octopart.com/UUX1H101MNL1GS-Nichicon-datasheet-62047998.pdf; Supplier 1: TME; Supplier Part Number 1: UUX1H101MNL1GS; Supplier 2: RS Components; Supplier Part Number 2: 739-3107; Supplier 3: Farnell; Supplier Part Number 3: 2841943; Supplier 4: Mouser; Supplier Part Number 4: 647-UUX1H101MNL1GS; Supplier 5: Digi-Key; Supplier Part Number 5: 493-6269-1-ND
D501 = D_1N5819HW_1A_40V_SOD123: Voltage: 40V; Current: 1A; SCH_Footprint: SOD123; Part Number: D_1N5819HW_1A_40V_SOD123; Supplier 1: TME; Supplier 2: RS Components; Supplier 3: Farnell; Supplier 4: Mouser; Supplier 5: Digi-Key
D502 = D_S1B_1A_100V_SMA: as D201 on sheet PART2_zener_stab; Part Number: D_S1B_1A_100V_SMA; Manufacturer Part Number: S1B; Supplier 1: TME; Supplier 2: RS Components; Supplier 3: Farnell; Supplier 4: Mouser; Supplier Part Number 4: 821-S1B; Supplier 5: Digi-Key; Supplier Part Number 5: S1B/51GI
D503 = OL_G_0805_0C006_LTST-C171GKT: LED GREEN; Manufacturer: Lite-On; Part Number: OL_G_0805_0C006_LTST-C171GKT; HelpURL: http://datasheet.octopart.com/LTST-C171GKT-Lite-On-datasheet-158474.pdf; Manufacturer Part Number: LTST-C171GKT; Supplier 1: TME; Supplier Part Number 1: LTST-C171GKT; Supplier 2: RS Components; Supplier Part Number 2: 6920935; Supplier 3: Farnell; Supplier 4: Mouser; Supplier Part Number 4: 859-LTST-C171GKT; Supplier 5: Digi-Key; Supplier Part Number 5: 160-1423-1-ND
L501 = L_220uH_1.29A_DR127: Induction; Manufacturer: Eaton; Manufacturer Part Number: DR127-221-R; Current: 1.29A; Resistance: 376mR; Part Number: L_220uH_1.29A_DR127; HelpURL: https://datasheet.octopart.com/DR127-221-R-Eaton-datasheet-552538.pdf; Supplier 1: TME; Supplier 2: RS Components; Supplier Part Number 2: 7701028; Supplier 3: Farnell; Supplier Part Number 3: 2369123; Supplier 4: Mouser; Supplier Part Number 4: 704-DR127-221-R; Supplier 5: Digi-Key; Supplier Part Number 5: 513-1045-1-ND
P501 P502 = P_HEADER_1x3_2.54: Pin Header; Manufacturer: Connfly; Part Number: P_HEADER_1x3_2.54; Component Type: Standard; HelpURL: http://www.tme.eu/en/Document/cc301e58a5da78cb543a94b5a5b7f06a/DS1021.pdf; Manufacturer Part Number: DS1021-1*3SF1-1; Supplier 1: TME; Supplier Part Number 1: ZL201-03G; Supplier 2: RS Components; Supplier 3: Farnell; Supplier 4: Mouser; Supplier 5: Digi-Key
R501 = R_330m_1206_1: Manufacturer: Panasonic; Manufacturer Part Number: ERJ-8RQFR33V; Voltage: 256mV; Power: 250mW; Tolerance: 1%; Part Number: R_330m_1206_1; HelpURL: https://pl.mouser.com/datasheet/2/315/AOA0000C313-1141758.pdf; Supplier 1: TME; Supplier 2: RS Components; Supplier Part Number 2: 721-5754; Supplier 3: Farnell; Supplier Part Number 3: 1717846; Supplier 4: Mouser; Supplier Part Number 4: 667-ERJ-8RQFR33V; Supplier 5: Digi-Key; Supplier Part Number 5: P.33RCT-ND
R502 = R_6.8k_0805_1: Manufacturer: Royalohm; Manufacturer Part Number: HP05W3F6801T5E; Voltage: 150V; Power: 300mW; Tolerance: 1%; Part Number: R_6.8k_0805_1; HelpURL: https://www.tme.eu/pl/Document/fa390a0a31e891a154d3713216995c6e/HighPowerHP.pdf; Supplier 1: TME; Supplier Part Number 1: HP05-6K81%; Supplier 2: RS Components; Supplier 3: Farnell; Supplier 4: Mouser; Supplier 5: Digi-Key
R503 = R_1k_0805_1: as R101 on sheet PART1_filters; Part Number: R_1k_0805_1; HelpURL: https://www.tme.eu/pl/Document/63d5a2fbb689d2d511047d7cc8640cd8/chip_resistor_hp.pdf; Supplier 1: TME; Supplier Part Number 1: HP05-1K1%; Supplier 2: RS Components; Supplier 3: Farnell; Supplier 4: Mouser; Supplier 5: Digi-Key
R504 = R_2.2k_0805_1: Manufacturer: Royalohm; Manufacturer Part Number: HP05W3F2201T5E; Voltage: 150V; Power: 300mW; Tolerance: 1%; Part Number: R_2.2k_0805_1; HelpURL: https://www.tme.eu/pl/Document/fa390a0a31e891a154d3713216995c6e/HighPowerHP.pdf; Supplier 1: TME; Supplier Part Number 1: HP05-2K21%; Supplier 2: RS Components; Supplier 3: Farnell; Supplier 4: Mouser; Supplier 5: Digi-Key
TP501-TP504 = TP_1PIN: Testpoint; SCH_Footprint: Single; Part Number: TP_1PIN; Component Type: Standard; Supplier 1: TME; Supplier 2: RS Components; Supplier 3: Farnell; Supplier 4: Mouser; Supplier 5: Digi-Key
U501 = U_MC34063AD: Manufacturer: Texas Instruments; SCH_Footprint: SOIC8; Value: MC34063AD; Part Number: U_MC34063AD; HelpURL: https://www.ti.com/lit/ds/symlink/mc34063a.pdf?ts=1594733387223; Manufacturer Part Number: MC34063AD; Supplier 1: TME; Supplier 2: RS Components; Supplier Part Number 2: 661-8436; Supplier 3: Farnell; Supplier Part Number 3: 3007277; Supplier 4: Mouser; Supplier Part Number 4: 595-MC34063AD; Supplier 5: Digi-Key

## Sheet PART6_Step_Up_PSU.SchDoc
size A4
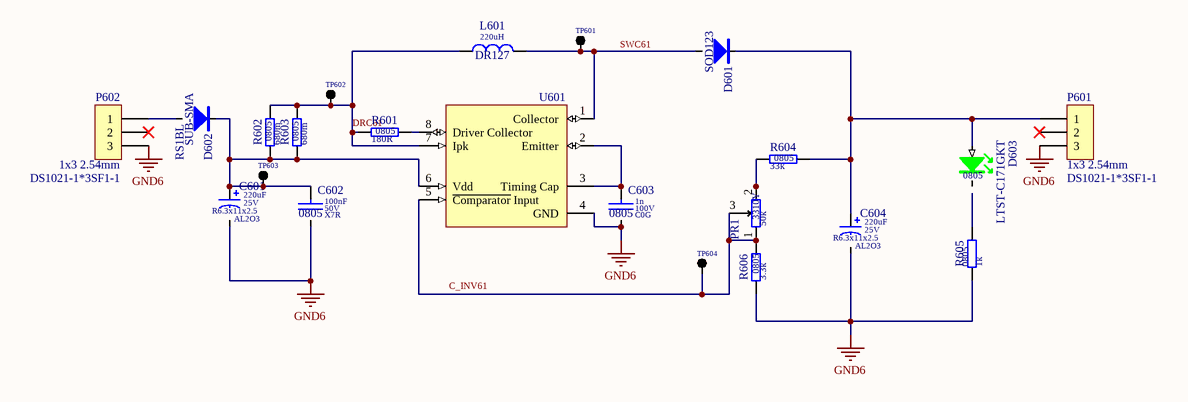
[diagram p5: PART6_Step_Up_PSU.SchDoc]

### Parts
C601  value 220uF  Dielectric: AL2O3  SCH_Footprint: R6.3x11x2.5  Voltage: 25V  [C_R6.3x11x2.5]  (hidden comment: Electrolytic Capacitor)
C602  value 100nF  Dielectric: X7R  Voltage: 50V  SCH_Footprint: 0805  [C_0805_2012]  (hidden comment: Ceramic X7R)
C603  value 1n  Dielectric: C0G  Voltage: 100V  SCH_Footprint: 0805  [C_0805_2012]  (hidden comment: Ceramic C0G)
C604  value 220uF  Dielectric: AL2O3  SCH_Footprint: R6.3x11x2.5  Voltage: 25V  [C_R6.3x11x2.5]  (hidden comment: Electrolytic Capacitor)
D601  1N5819HW  [SOD123]  (value not drawn)
D602  value RS1BL  [SUB-SMA]  (hidden comment: RS1BL fast rectifier)
D603  value LTST-C171GKT  SCH_Footprint: 0805  [OL_0805_2012]  (hidden comment: Green led)
L601  value 220uH  SCH_Footprint: DR127  [L_DR127]  (hidden comment: Inductor)
P601  value DS1021-1*3SF1-1  SCH_Footprint: 1x3 2.54mm  [P_HEADER_1x3_2.54]  (hidden comment: Goldpin)
P602  value DS1021-1*3SF1-1  SCH_Footprint: 1x3 2.54mm  [P_HEADER_1x3_2.54]  (hidden comment: Goldpin)
PR1  value 50k  [3310Y]  (hidden comment: Resistor)
R601  value 180R  SCH_Footprint: 0805  [R_0805_2012]  (hidden comment: Resistor)
R602  value 680m  SCH_Footprint: 0805  [R_0805_2012]  (hidden comment: Resistor)
R603  value 680m  SCH_Footprint: 0805  [R_0805_2012]  (hidden comment: Resistor)
R604  value 33k  SCH_Footprint: 0805  [R_0805_2012]  (hidden comment: Resistor)
R605  value 1k  SCH_Footprint: 0805  [R_0805_2012]  (hidden comment: Resistor)
R606  value 3.3k  SCH_Footprint: 0805  [R_0805_2012]  (hidden comment: Resistor)
TP601  Single pin  [TP_1PIN]  (value not drawn)
TP602  Single pin  [TP_1PIN]  (value not drawn)
TP603  Single pin  [TP_1PIN]  (value not drawn)
TP604  Single pin  [TP_1PIN]  (value not drawn)
U601  1.5-A Peak Boost/Buck/Inverting Switching Regulators  [SOP8_SO8_SOIC8_4X5X18]  (value not drawn)

### Nets
GND6: C601.2 C602.2 C603.2 C604.2 P601.3 P602.3 R605.1 R606.1 U601.4(GND)
DRC61: L601.1 R601.1 R602.2 R603.2 TP602.1(TP) U601.7(Ipk)
SWC61: D601.2 L601.2 TP601.1(TP) U601.1(Collector)
NetC601_1: C601.1 C602.1 D602.1 R602.1 R603.1 TP603.1(TP) U601.6(Vdd)
NetC603_1: C603.1 U601.2(Emitter) U601.3(Timing_Cap)
NetC604_1: C604.1 D601.1 D603.2(A) P601.1 R604.2
NetD602_2: D602.2 P602.1
NetPR1_1: PR1.1 PR1.3 R606.2 TP604.1(TP) U601.5(~{Comparator}_Input)
NetPR1_2: PR1.2 R604.1
NetR601_2: R601.2 U601.8(Driver_Collector)

Not connected (* = marked no-connect by the designer): D603 1(K); P601 2*; P602 2*; R605 2

### Notes on the sheet
- Labels drawn without touching a wire or pin: C_INV61

### Library data of the parts
C601 C604 = CE_220uF_25V_6.3x11x2.5_LESR_20: Polarized Capacitor; Manufacturer: Samxon; Manufacturer Part Number: GF 220U/25V; Tolerance (%): 20; Part Number: CE_220uF_25V_6.3x11x2.5_LESR_20; HelpURL: http://www.tme.eu/pl/Document/9fe41abe6e7b7973ea4089f212d099cc/E-GF_series.pdf; Supplier 1: TME; Supplier Part Number 1: GF220/25; Supplier 2: RS Components; Supplier 3: Farnell; Supplier 4: Mouser; Supplier 5: Digi-Key
C602 = C_100nF_50V_X7R_0805_10: Capacitor; Manufacturer: AVX; Manufacturer Part Number: 08055C104K4T2A; Tolerance (%): 10; Part Number: C_100nF_50V_X7R_0805_10; HelpURL: http://www.tme.eu/pl/Document/943bdb20b23b898c4d4b2ec4eca4f2b6/cauto.pdf; Supplier 1: TME; Supplier Part Number 1: 08055C104K4T2A; Supplier 2: RS Components; Supplier 3: Farnell; Supplier 4: Mouser; Supplier 5: Digi-Key
C603 = C_1nF_100V_C0G_0805_5: Capacitor; Manufacturer: Walsin; Manufacturer Part Number: 0805N102J101CT; Tolerance (%): 5; Part Number: C_1nF_100V_C0G_0805_5; HelpURL: https://datasheet.octopart.com/0805N102J101CT-Walsin-Technologies-datasheet-48038160.pdf; Supplier 1: TME; Supplier Part Number 1: 0805N102J101CT; Supplier 2: RS Components; Supplier 3: Farnell; Supplier Part Number 3: 2497011; Supplier 4: Mouser; Supplier Part Number 4: 791-0805N102J101CT; Supplier 5: Digi-Key
D601 = D_1N5819HW_1A_40V_SOD123: Voltage: 40V; Current: 1A; SCH_Footprint: SOD123; Part Number: D_1N5819HW_1A_40V_SOD123; Supplier 1: TME; Supplier 2: RS Components; Supplier 3: Farnell; Supplier 4: Mouser; Supplier 5: Digi-Key
D602 = D_RS1BL_100V_1A_SUB-SMA: Manufacturer: Taiwan Semiconductor; Voltage: 100V; Current: 1A; SCH_Footprint: SUB-SMA; Part Number: D_RS1BL_100V_1A_SUB-SMA; HelpURL: http://www.mouser.com/ds/2/395/RS1AL%20SERIES_K14-523620.pdf; Manufacturer Part Number: RS1BL; Supplier 1: TME; Supplier 2: RS Components; Supplier 3: Farnell; Supplier 4: Mouser; Supplier 5: Digi-Key
D603 = OL_G_0805_0C006_LTST-C171GKT: LED GREEN; Manufacturer: Lite-On; Part Number: OL_G_0805_0C006_LTST-C171GKT; HelpURL: http://datasheet.octopart.com/LTST-C171GKT-Lite-On-datasheet-158474.pdf; Manufacturer Part Number: LTST-C171GKT; Supplier 1: TME; Supplier Part Number 1: LTST-C171GKT; Supplier 2: RS Components; Supplier Part Number 2: 6920935; Supplier 3: Farnell; Supplier 4: Mouser; Supplier Part Number 4: 859-LTST-C171GKT; Supplier 5: Digi-Key; Supplier Part Number 5: 160-1423-1-ND
L601 = L_220uH_1.29A_DR127: as L501 on sheet PART5_Step_Down_PSU; Part Number: L_220uH_1.29A_DR127; HelpURL: https://datasheet.octopart.com/DR127-221-R-Eaton-datasheet-552538.pdf; Supplier 1: TME; Supplier 2: RS Components; Supplier Part Number 2: 7701028; Supplier 3: Farnell; Supplier Part Number 3: 2369123; Supplier 4: Mouser; Supplier Part Number 4: 704-DR127-221-R; Supplier 5: Digi-Key; Supplier Part Number 5: 513-1045-1-ND
P601 P602 = P_HEADER_1x3_2.54: Pin Header; Manufacturer: Connfly; Part Number: P_HEADER_1x3_2.54; Component Type: Standard; HelpURL: http://www.tme.eu/en/Document/cc301e58a5da78cb543a94b5a5b7f06a/DS1021.pdf; Manufacturer Part Number: DS1021-1*3SF1-1; Supplier 1: TME; Supplier Part Number 1: ZL201-03G; Supplier 2: RS Components; Supplier 3: Farnell; Supplier 4: Mouser; Supplier 5: Digi-Key
PR1 = R_50k_3310Y_20: Manufacturer: Bourns; Manufacturer Part Number: 3310Y-001-503L; Voltage: 50V; Power: 250mW; Tolerance: 20%; SCH_Footprint: 3310Y; Part Number: R_50k_3310Y_20; HelpURL: https://docs.rs-online.com/4641/0900766b8069b9f0.pdf; Supplier 1: TME; Supplier Part Number 1: 3310Y-001-503L; Supplier 2: RS Components; Supplier Part Number 2: 522-0697; Supplier 3: Farnell; Supplier Part Number 3: 9354000; Supplier 4: Mouser; Supplier 5: Digi-Key; Supplier Part Number 5: 3310Y-001-503L-ND
R601 = R_180R_0805_1: Manufacturer: Royalohm; Manufacturer Part Number: 0805S8F1800T5E; Voltage: 150V; Power: 125mW; Tolerance: 1%; Part Number: R_180R_0805_1; HelpURL: https://www.tme.eu/pl/Document/b315665a56acbc42df513c99b390ad98/ROYALOHM-THICKFILM.pdf; Supplier 1: TME; Supplier Part Number 1: SMD0805-180R-1%; Supplier 2: RS Components; Supplier 3: Farnell; Supplier 4: Mouser; Supplier 5: Digi-Key
R602 R603 = R_680m_0805_5: Manufacturer: Viking; Manufacturer Part Number: CS05JTFVR680; Voltage: 100V; Power: 250mW; Tolerance: 5%; Part Number: R_680m_0805_5; HelpURL: https://datasheet.octopart.com/CS05JTFVR680-Viking-datasheet-81455976.pdf; Supplier 1: TME; Supplier Part Number 1: CS0805-0R68-5%-HP; Supplier 2: RS Components; Supplier 3: Farnell; Supplier 4: Mouser; Supplier 5: Digi-Key
R604 = R_33k_0805_1: Manufacturer: Royalohm; Manufacturer Part Number: HP05W3F3302T5E; Voltage: 150V; Power: 300mW; Tolerance: 1%; Part Number: R_33k_0805_1; HelpURL: https://www.tme.eu/pl/Document/fa390a0a31e891a154d3713216995c6e/HighPowerHP.pdf; Supplier 1: TME; Supplier Part Number 1: HP05-33K1%; Supplier 2: RS Components; Supplier 3: Farnell; Supplier 4: Mouser; Supplier 5: Digi-Key
R605 = R_1k_0805_1: as R101 on sheet PART1_filters; Part Number: R_1k_0805_1; HelpURL: https://www.tme.eu/pl/Document/63d5a2fbb689d2d511047d7cc8640cd8/chip_resistor_hp.pdf; Supplier 1: TME; Supplier Part Number 1: HP05-1K1%; Supplier 2: RS Components; Supplier 3: Farnell; Supplier 4: Mouser; Supplier 5: Digi-Key
R606 = R_3.3k_0805_1: Manufacturer: Royalohm; Manufacturer Part Number: HP05W3F3301T5E; Voltage: 150V; Power: 300mW; Tolerance: 1%; Part Number: R_3.3k_0805_1; HelpURL: https://www.tme.eu/pl/Document/fa390a0a31e891a154d3713216995c6e/HighPowerHP.pdf; Supplier 1: TME; Supplier Part Number 1: HP05-3K31%; Supplier 2: RS Components; Supplier 3: Farnell; Supplier 4: Mouser; Supplier Part Number 4: 603-RC0805FR-073K3L; Supplier 5: Digi-Key; Supplier Part Number 5: 311-3.30KCRCT-ND
TP601-TP604 = TP_1PIN: Testpoint; SCH_Footprint: Single; Part Number: TP_1PIN; Component Type: Standard; Supplier 1: TME; Supplier 2: RS Components; Supplier 3: Farnell; Supplier 4: Mouser; Supplier 5: Digi-Key
U601 = U_MC34063AD: as U501 on sheet PART5_Step_Down_PSU; Value: MC34063AD; Part Number: U_MC34063AD; HelpURL: https://www.ti.com/lit/ds/symlink/mc34063a.pdf?ts=1594733387223; Manufacturer Part Number: MC34063AD; Supplier 1: TME; Supplier 2: RS Components; Supplier Part Number 2: 661-8436; Supplier 3: Farnell; Supplier Part Number 3: 3007277; Supplier 4: Mouser; Supplier Part Number 4: 595-MC34063AD; Supplier 5: Digi-Key

## Sheet PART8_Volt_Multipl.SchDoc
size A4
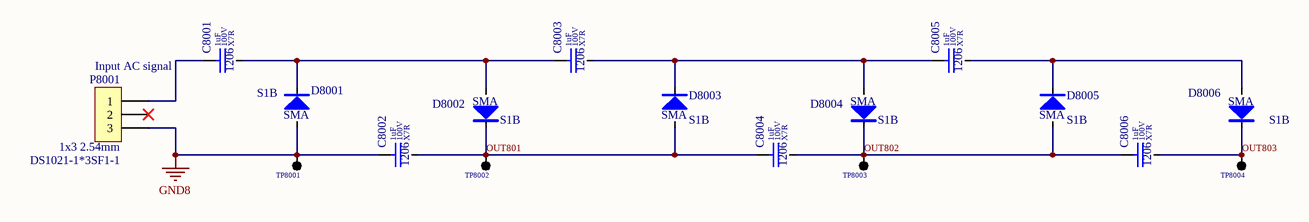
[diagram p6: PART8_Volt_Multipl.SchDoc]

### Parts
C8001  value 1uF  Dielectric: X7R  Voltage: 100V  SCH_Footprint: 1206  [C_1206_3216]  (hidden comment: Ceramic X7R)
C8002  value 1uF  Dielectric: X7R  Voltage: 100V  SCH_Footprint: 1206  [C_1206_3216]  (hidden comment: Ceramic X7R)
C8003  value 1uF  Dielectric: X7R  Voltage: 100V  SCH_Footprint: 1206  [C_1206_3216]  (hidden comment: Ceramic X7R)
C8004  value 1uF  Dielectric: X7R  Voltage: 100V  SCH_Footprint: 1206  [C_1206_3216]  (hidden comment: Ceramic X7R)
C8005  value 1uF  Dielectric: X7R  Voltage: 100V  SCH_Footprint: 1206  [C_1206_3216]  (hidden comment: Ceramic X7R)
C8006  value 1uF  Dielectric: X7R  Voltage: 100V  SCH_Footprint: 1206  [C_1206_3216]  (hidden comment: Ceramic X7R)
D8001  value S1B  SCH_Footprint: SMA  [SMA_DO-214AC]
D8002  value S1B  SCH_Footprint: SMA  [SMA_DO-214AC]
D8003  value S1B  SCH_Footprint: SMA  [SMA_DO-214AC]
D8004  value S1B  SCH_Footprint: SMA  [SMA_DO-214AC]
D8005  value S1B  SCH_Footprint: SMA  [SMA_DO-214AC]
D8006  value S1B  SCH_Footprint: SMA  [SMA_DO-214AC]
P8001  Input AC signal  value DS1021-1*3SF1-1  SCH_Footprint: 1x3 2.54mm  [P_HEADER_1x3_2.54]
TP8001  Single pin  [TP_1PIN]  (value not drawn)
TP8002  Single pin  [TP_1PIN]  (value not drawn)
TP8003  Single pin  [TP_1PIN]  (value not drawn)
TP8004  Single pin  [TP_1PIN]  (value not drawn)

### Nets
GND8: C8002.1 D8001.2 P8001.3 TP8001.1(TP)
OUT801: C8002.2 C8004.1 D8002.1 D8003.2 TP8002.1(TP)
OUT802: C8004.2 C8006.1 D8004.1 D8005.2 TP8003.1(TP)
OUT803: C8006.2 D8006.1 TP8004.1(TP)
NetC8001_1: C8001.1 P8001.1
NetC8001_2: C8001.2 C8003.1 D8001.1 D8002.2
NetC8003_2: C8003.2 C8005.1 D8003.1 D8004.2
NetC8005_2: C8005.2 D8005.1 D8006.2

Not connected (* = marked no-connect by the designer): P8001 2*

### Library data of the parts
C8001-C8006 = C_1uF_100V_X7R_1206_10: Capacitor; Manufacturer: AVX; Manufacturer Part Number: 12061C105K4Z2A; Tolerance (%): 10; Part Number: C_1uF_100V_X7R_1206_10; HelpURL: https://www.tme.eu/Document/943bdb20b23b898c4d4b2ec4eca4f2b6/cauto.pdf; Supplier 1: TME; Supplier Part Number 1: 12061C105K4Z2A; Supplier 2: RS Components; Supplier Part Number 2: 136-4280; Supplier 3: Farnell; Supplier Part Number 3: 1833855; Supplier 4: Mouser; Supplier Part Number 4: 581-12061C105K4Z2A; Supplier 5: Digi-Key; Supplier Part Number 5: 478-9923-1-ND
D8001-D8006 = D_S1B_1A_100V_SMA: as D201 on sheet PART2_zener_stab; Part Number: D_S1B_1A_100V_SMA; Manufacturer Part Number: S1B; Supplier 1: TME; Supplier 2: RS Components; Supplier 3: Farnell; Supplier 4: Mouser; Supplier Part Number 4: 821-S1B; Supplier 5: Digi-Key; Supplier Part Number 5: S1B/51GI
P8001 = P_HEADER_1x3_2.54: Pin Header; Manufacturer: Connfly; Part Number: P_HEADER_1x3_2.54; Component Type: Standard; HelpURL: http://www.tme.eu/en/Document/cc301e58a5da78cb543a94b5a5b7f06a/DS1021.pdf; Manufacturer Part Number: DS1021-1*3SF1-1; Supplier 1: TME; Supplier Part Number 1: ZL201-03G; Supplier 2: RS Components; Supplier 3: Farnell; Supplier 4: Mouser; Supplier 5: Digi-Key
TP8001-TP8004 = TP_1PIN: Testpoint; SCH_Footprint: Single; Part Number: TP_1PIN; Component Type: Standard; Supplier 1: TME; Supplier 2: RS Components; Supplier 3: Farnell; Supplier 4: Mouser; Supplier 5: Digi-Key